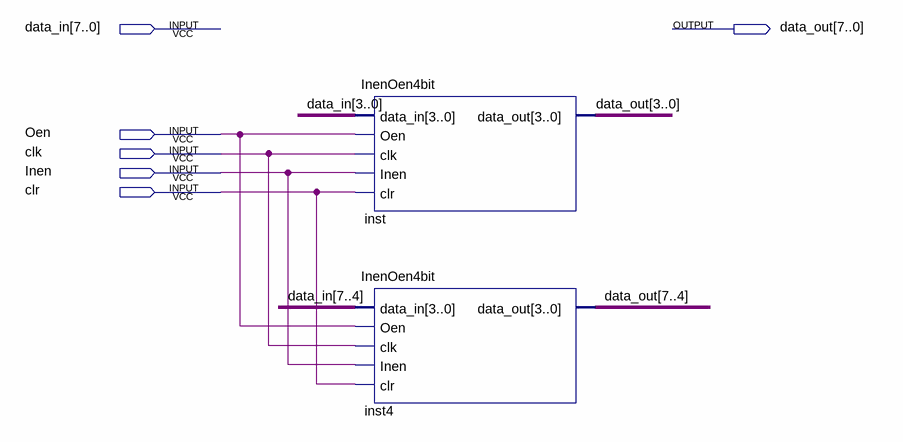
[diagram p0: schematic sheet]
// Quartus schematic InenOen8bit.bdf as structural Verilog: 2 symbols, 6 pins
module InenOen8bit (
  input  [7:0] data_in,
  input  Oen,
  input  clk,
  input  Inen,
  input  clr,
  output [7:0] data_out
);

  InenOen4bit inst (.data_in(data_in[3:0]), .Oen(Oen), .clk(clk), .Inen(Inen), .clr(clr), .data_out(data_out[3:0]));
  InenOen4bit inst4 (.data_in(data_in[7:4]), .Oen(Oen), .clk(clk), .Inen(Inen), .clr(clr), .data_out(data_out[7:4]));
endmodule
